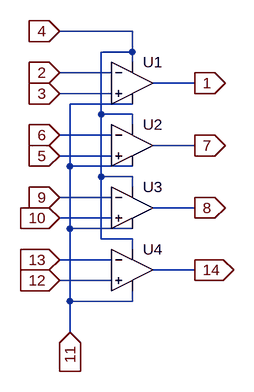
[diagram p0: schematic Comparador.asc]
Comparador.asc, the LTspice schematic file:
Version 4
SHEET 1 880 680
WIRE 96 0 -16 0
WIRE 96 32 96 0
WIRE 96 32 48 32
WIRE 96 48 96 32
WIRE 64 64 -16 64
WIRE 192 80 128 80
WIRE 64 96 -16 96
WIRE 96 112 0 112
WIRE 48 128 48 32
WIRE 96 128 48 128
WIRE 96 144 96 128
WIRE 64 160 -16 160
WIRE 192 176 128 176
WIRE 64 192 -16 192
WIRE 0 208 0 112
WIRE 96 208 0 208
WIRE 48 224 48 128
WIRE 96 224 48 224
WIRE 96 240 96 224
WIRE 64 256 -16 256
WIRE 192 272 128 272
WIRE 64 288 -16 288
WIRE 0 304 0 208
WIRE 96 304 0 304
WIRE 48 320 48 224
WIRE 96 320 48 320
WIRE 96 336 96 320
WIRE 64 352 -16 352
WIRE 192 368 128 368
WIRE 64 384 -16 384
WIRE 0 416 0 304
WIRE 96 416 96 400
WIRE 96 416 0 416
WIRE 0 464 0 416
FLAG 192 80 1
IOPIN 192 80 Out
FLAG 192 176 7
IOPIN 192 176 Out
FLAG 192 272 8
IOPIN 192 272 Out
FLAG 192 368 14
IOPIN 192 368 Out
FLAG -16 96 3
IOPIN -16 96 In
FLAG -16 64 2
IOPIN -16 64 In
FLAG -16 160 6
IOPIN -16 160 In
FLAG -16 192 5
IOPIN -16 192 In
FLAG -16 256 9
IOPIN -16 256 In
FLAG -16 288 10
IOPIN -16 288 In
FLAG -16 352 13
IOPIN -16 352 In
FLAG -16 384 12
IOPIN -16 384 In
FLAG -16 0 4
IOPIN -16 0 In
FLAG 0 464 11
IOPIN 0 464 In
SYMBOL Opamps\\UniversalOpamp2 96 80 R0
SYMATTR InstName U1
SYMBOL Opamps\\UniversalOpamp2 96 176 R0
SYMATTR InstName U2
SYMBOL Opamps\\UniversalOpamp2 96 272 R0
SYMATTR InstName U3
SYMBOL Opamps\\UniversalOpamp2 96 368 R0
SYMATTR InstName U4

The netlist it stands for:
* Comparador.asc
XU1 3 2 4 11 1 level.2 Avol=1Meg GBW=10Meg Slew=10Meg ilimit=25m rail=0 Vos=0 phimargin=45 en=0 enk=0 in=0 ink=0 Rin=500Meg  ; pins IN+ IN- V+ V- OUT
XU2 5 6 4 11 7 level.2 Avol=1Meg GBW=10Meg Slew=10Meg ilimit=25m rail=0 Vos=0 phimargin=45 en=0 enk=0 in=0 ink=0 Rin=500Meg  ; pins IN+ IN- V+ V- OUT
XU3 10 9 4 11 8 level.2 Avol=1Meg GBW=10Meg Slew=10Meg ilimit=25m rail=0 Vos=0 phimargin=45 en=0 enk=0 in=0 ink=0 Rin=500Meg  ; pins IN+ IN- V+ V- OUT
XU4 12 13 4 11 14 level.2 Avol=1Meg GBW=10Meg Slew=10Meg ilimit=25m rail=0 Vos=0 phimargin=45 en=0 enk=0 in=0 ink=0 Rin=500Meg  ; pins IN+ IN- V+ V- OUT
.lib UniversalOpamps2.sub
.backanno
.end